# EAGLE design TinkerAccess Remote RFID (EAGLE 9.6.2)
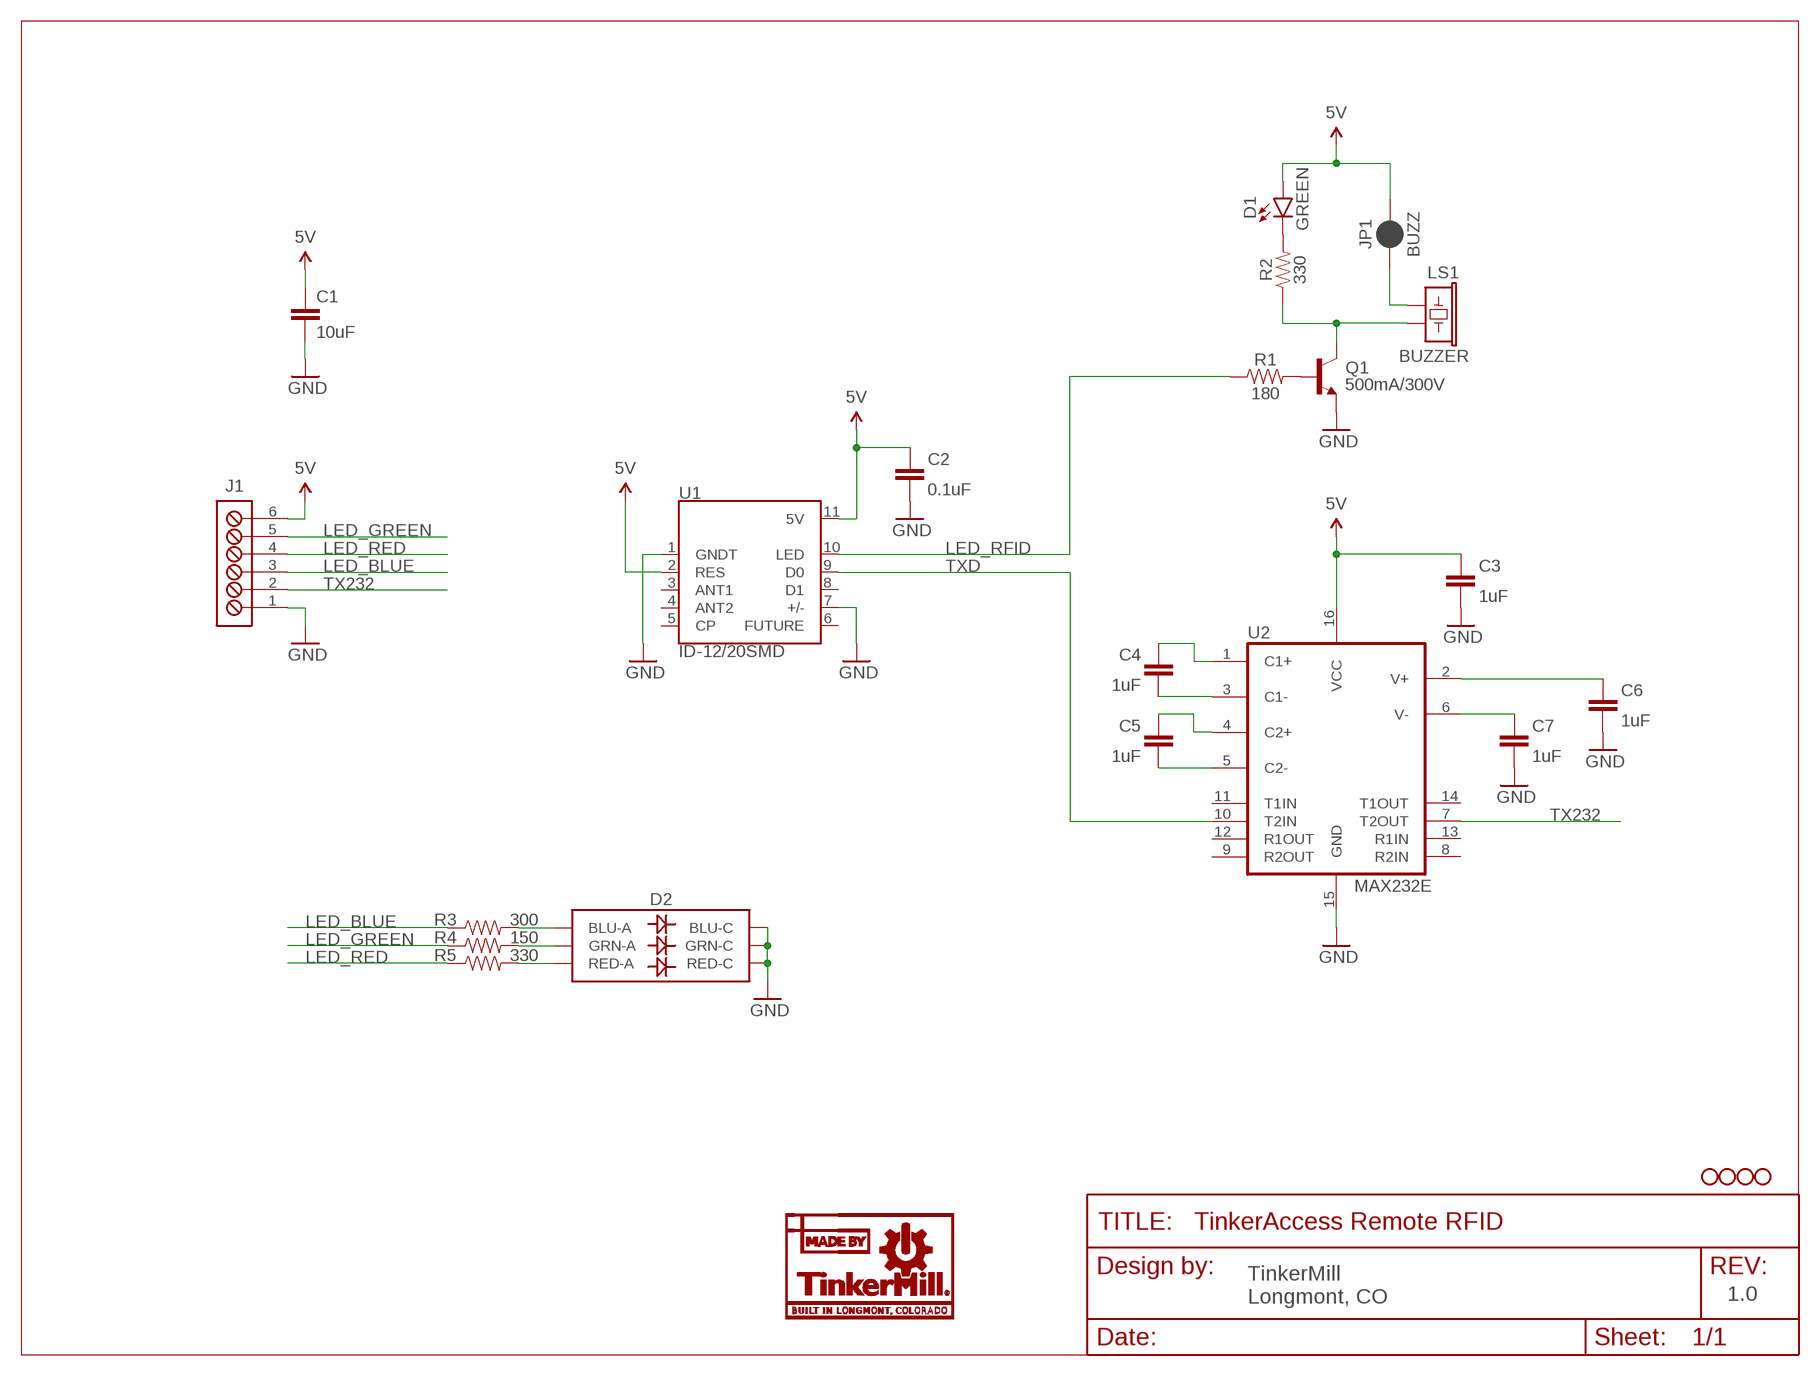
[diagram p0: schematic, sheet 1]

## Parts
C1  10uF  10UF-1206-6.3V-20%  [1206]
C2  0.1uF  0.1UF-0603-25V-(+80/-20%)  [0603]
C3  1uF  0.1UF-0603-25V-(+80/-20%)  [0603]
C4  1uF  0.1UF-0603-25V-(+80/-20%)  [0603]
C5  1uF  0.1UF-0603-25V-(+80/-20%)  [0603]
C6  1uF  0.1UF-0603-25V-(+80/-20%)  [0603]
C7  1uF  0.1UF-0603-25V-(+80/-20%)  [0603]
D1  GREEN  LED-GREEN1206  [LED-1206]
D2  LED-RGBNO_IC  [LED-TRICOLOR-5050]
J1  TB_6X1_TE_CONN_ED555_6DS  [TE_CONN_ED555_6DS]
JP1  BUZZ  JUMPER-SMT_2_NC_PASTE_NO-SILK  [SMT-JUMPER_2_NC_PASTE_NO-SILK]
LOGO1  MADE_BY_TINKERMILL  [MADE_BY_TINKERMILL]
LS1  BUZZER  BUZZER-SMD  [BUZZER-CCV]
Q1  500mA/300V  TRANS_NPN-MMBTA42  [SOT23-3]
R1  180  10MOHM-0603-1/10W-5%  [0603]
R2  330  10MOHM-0603-1/10W-5%  [0603]
R3  300  300OHM-0603-1/10W-1%  [0603]
R4  150  150OHM-0603-1/10W-1%  [0603]
R5  330  330OHM-0603-1/10W-1%  [0603]
STANDOFF1  STANDOFF_3.2MM_NO_CU_MASK  [STANDOFF_3.2MM_NO_CU_MASK]
STANDOFF2  STANDOFF_3.2MM_NO_CU_MASK  [STANDOFF_3.2MM_NO_CU_MASK]
STANDOFF3  STANDOFF_3.2MM_NO_CU_MASK  [STANDOFF_3.2MM_NO_CU_MASK]
STANDOFF4  STANDOFF_3.2MM_NO_CU_MASK  [STANDOFF_3.2MM_NO_CU_MASK]
U1  ID-12/20SMD  [ID-12_SMD]
U2  MAX232E  MAX232TSSOP  [TSSOP16]

## Nets
5V: C1.1 C2.2 C3.2 D1.A J1.6 JP1.2 U1.2(RES) U1.11(5V) U2.16(VCC)
GND: C1.2 C2.1 C3.1 C6.1 C7.1 D2.4(BLU-C) D2.5(RED-C) D2.6(GRN-C) J1.1 Q1.2(E) U1.1(GNDT) U1.7(+/-) U2.15(GND)
LED_BLUE: J1.3 R3.1
LED_GREEN: J1.5 R4.1
LED_RED: J1.4 R5.1
LED_RFID: R1.1 U1.10(LED)
N$1: Q1.1(B) R1.2
N$2: JP1.1 LS1.+
N$3: LS1.- Q1.3(C) R2.1
N$4: D1.C R2.2
N$5: C4.1 U2.3(C1-)
N$6: C4.2 U2.1(C1+)
N$7: C5.1 U2.5(C2-)
N$8: C5.2 U2.4(C2+)
N$9: D2.2(RED-A) R5.2
N$10: D2.1(GRN-A) R4.2
N$11: D2.3(BLU-A) R3.2
N$12: C6.2 U2.2(V+)
N$13: C7.2 U2.6(V-)
TX232: J1.2 U2.7(T2OUT)
TXD: U1.9(D0) U2.10(T2IN)
Unconnected: U1.3(ANT1) U1.4(ANT2) U1.5(CP) U1.6(FUTURE) U1.8(D1) U2.8(R2IN) U2.9(R2OUT) U2.11(T1IN) U2.12(R1OUT) U2.13(R1IN) U2.14(T1OUT)

## Notes on the sheet
- TinkerMill
  Longmont, CO
- 1.0

## Library data of the parts
C1 = SparkFun-Capacitors:10UF: 10.0µF ceramic capacitors A capacitor is a passive two-terminal electrical component used to store electrical energy temporarily in an electric field.; PROD_ID: CAP-10057
C2 = SparkFun-Capacitors:0.1UF: 0.1µF ceramic capacitors A capacitor is a passive two-terminal electrical component used to store electrical energy temporarily in an electric field.; PROD_ID: CAP-00810
C3-C7 = SparkFun-Capacitors:0.1UF: 0.1µF ceramic capacitors A capacitor is a passive two-terminal electrical component used to store electrical energy temporarily in an electric field.; PROD_ID: CAP-00810; VALUE: 0.1uF
D1 = SparkFun-LED:LED-GREEN: Green SMD LED Used in manufacturing of various products at SparkFun Packages: 0603 - SMD 0603 package [Product Link] <http://www.futureelectronics.com/en/technologies/semiconductors/optoelectronics/leds/Pages/9894312-LTST-C190GKT.aspx?CrossPart=HSMG-C190&IM=0> LilyPad 1206 - SMD1206 LilyPad package [Product Link] <http://www.futureelectronics.com/en/Technologies/Product.aspx?ProductID=IN150NGHARVATEKCORPORATION2049943&IM=0> 1206 - SMD1206 package [Product Link] <http://www.futureelectronics.com/en/technologies/semiconductors/optoelectronics/leds/Pages/8315665-LTST-C150KGKT.aspx?IM=0> 1206 Bottom Mount -SMD 1206 Bottom Mount [Product Link] <http://www.digikey.com/product-detail/en/lite-on-inc/LTST-C230KGKT/160-1456-1-ND/386854> SparkFun Products: Pro Mini 328 -5V <https://www.sparkfun.com/products/821> RedBoard <https://www.sparkfun.com/products/12757> MP3 Trigger <https://www.sparkfun.com/products/13720> Makey Makey <https://www.sparkfun.com/products/11076>; PROD_ID: DIO-00862
D2 = SparkFun-LED:LED-RGB: LED-RGB 6 pin RGB LED (no common connector) Packages: PLCC-6 LED-TRICOLOR-5050 - No built-in IC SparkFun Products: Digital Sandbox <https://www.sparkfun.com/products/12651> LED- SMD RGB <https://www.sparkfun.com/products/10866>; PROD_ID: DIO-10298
J1 = TMF_Connectors:TB_6X1
JP1 = SparkFun-Jumpers:JUMPER-SMT_2_NC_PASTE: Normally closed solder jumper This jumper has an aperture in the stencil to allow solder paste to bridge the split in the wire so it's normally closed (NC). Wick off the solder to open the connection. Reapply solder to reclose the connection.
LOGO1 = TinkerMill:MADE_BY_TINKERMILL
LS1 = SparkFun-Electromechanical:BUZZER: Buzzer Small round buzzers that operate around the audible 2kHz range. You can use these as speakers to create simple music or user interfaces. Variant Overview: PTH - Mini Speaker - PC Mount 12mm 2.048kHz <https://www.sparkfun.com/products/7950> PTH_KIT - Mini Speaker - PC Mount 12mm 2.048kHz <https://www.sparkfun.com/products/7950> KIT simplifies soldering by adding stop mask to one side of the pads. PTH_NO_SILK - Mini Speaker - PC Mount 12mm 2.048kHz <https://www.sparkfun.com/products/7950> No silkscreen indicator of buzzer outline. PTH_KIT_NO_SILK - Mini Speaker - PC Mount 12mm 2.048kHz <https://www.sparkfun.com/products/7950> KIT package w/o silkscreen SMD - Buzzer Audio Magnetic (CCV-084B16) SMD buzzer used on, e.g. the LilyPad Buzzer <https://www.sparkfun.com/products/8463> and RFID USB Reader <https://www.sparkfun.com/products/9963>. SMD_KIT - Buzzer Audio Magnetic (CCV-084B16) SMD Buzzer with elongated pins to make soldering easier. Used on the SparkFun Simon Says - Surface Mount Soldering Kit <https://www.sparkfun.com/products/10935>.; PROD_ID: COMP-08568
Q1 = SparkFun-DiscreteSemi:TRANS_NPN: NPN transistor Current controlled devices typically used to amplify current or used as a switch. BC547 - COM-08928 <http://www.sparkfun.com/products/8928> (TO-92 45V 100mA) (1.Collector 2.Base 3.Emitter) 2N3904 - COM-00521 <http://www.sparkfun.com/products/521> (TO-92 40V 200mA) (1.Emitter 2.Base 3.Collector) P2N2222A - COM-12852 <http://www.sparkfun.com/products/12852> (TO-92 40V 600mA) (1.Collector 2.Base 3.Emitter); PROD_ID: TRANS-09116
R1 R2 = SparkFun-Resistors:10MOHM: RES-09327; PROD_ID: RES-08283; VALUE: 10M
R3 = SparkFun-Resistors:300OHM: 300Ω resistor A resistor is a passive two-terminal electrical component that implements electrical resistance as a circuit element. Resistors act to reduce current flow, and, at the same time, act to lower voltage levels within circuits. - Wikipedia; PROD_ID: RES_10328
R4 = SparkFun-Resistors:150OHM: 150Ω resistor A resistor is a passive two-terminal electrical component that implements electrical resistance as a circuit element. Resistors act to reduce current flow, and, at the same time, act to lower voltage levels within circuits. - Wikipedia; PROD_ID: RES-11028
R5 = SparkFun-Resistors:330OHM: 330Ω resistor A resistor is a passive two-terminal electrical component that implements electrical resistance as a circuit element. Resistors act to reduce current flow, and, at the same time, act to lower voltage levels within circuits. - Wikipedia; PROD_ID: RES-00818
STANDOFF1-STANDOFF4 = TMF_Hardware:STANDOFF
U1 = SparkFun-RF:ID-12/20: ID Innovations 125kHz RFID Reader (ID2, ID3, ID12, and ID20) The IDS, ID3, ID12, and ID20 are very simple to use RFID reader modules. Power the module, hold up a 125kHz card, and get a serial string output containing the unique ID of the card. SparkFun Products RFID Reader ID-3LA (125 kHz) <https://www.sparkfun.com/products/11862> (SEN-11862) RFID Reader ID-12LA (125 kHz) <https://www.sparkfun.com/products/11827> (SEN-11827) RFID Reader ID-20LA (125 kHz) <https://www.sparkfun.com/products/11828> (SEN-11828) SparkFun RFID USB Reader <https://www.sparkfun.com/products/9963> (SEN-9963); PROD_ID: CONN-09345, CONN-09344
U2 = SparkFun-DigitalIC:MAX232: RS232 Transceiver Very common IC. This is generically called 'MAX232', but works with the 3V equivalent MAX3232 generic ICs. Field tested and mother approved. Spark Fun Electronics SKU : COM-00316 (DIP) and COM-00589 (SMD)

## Board
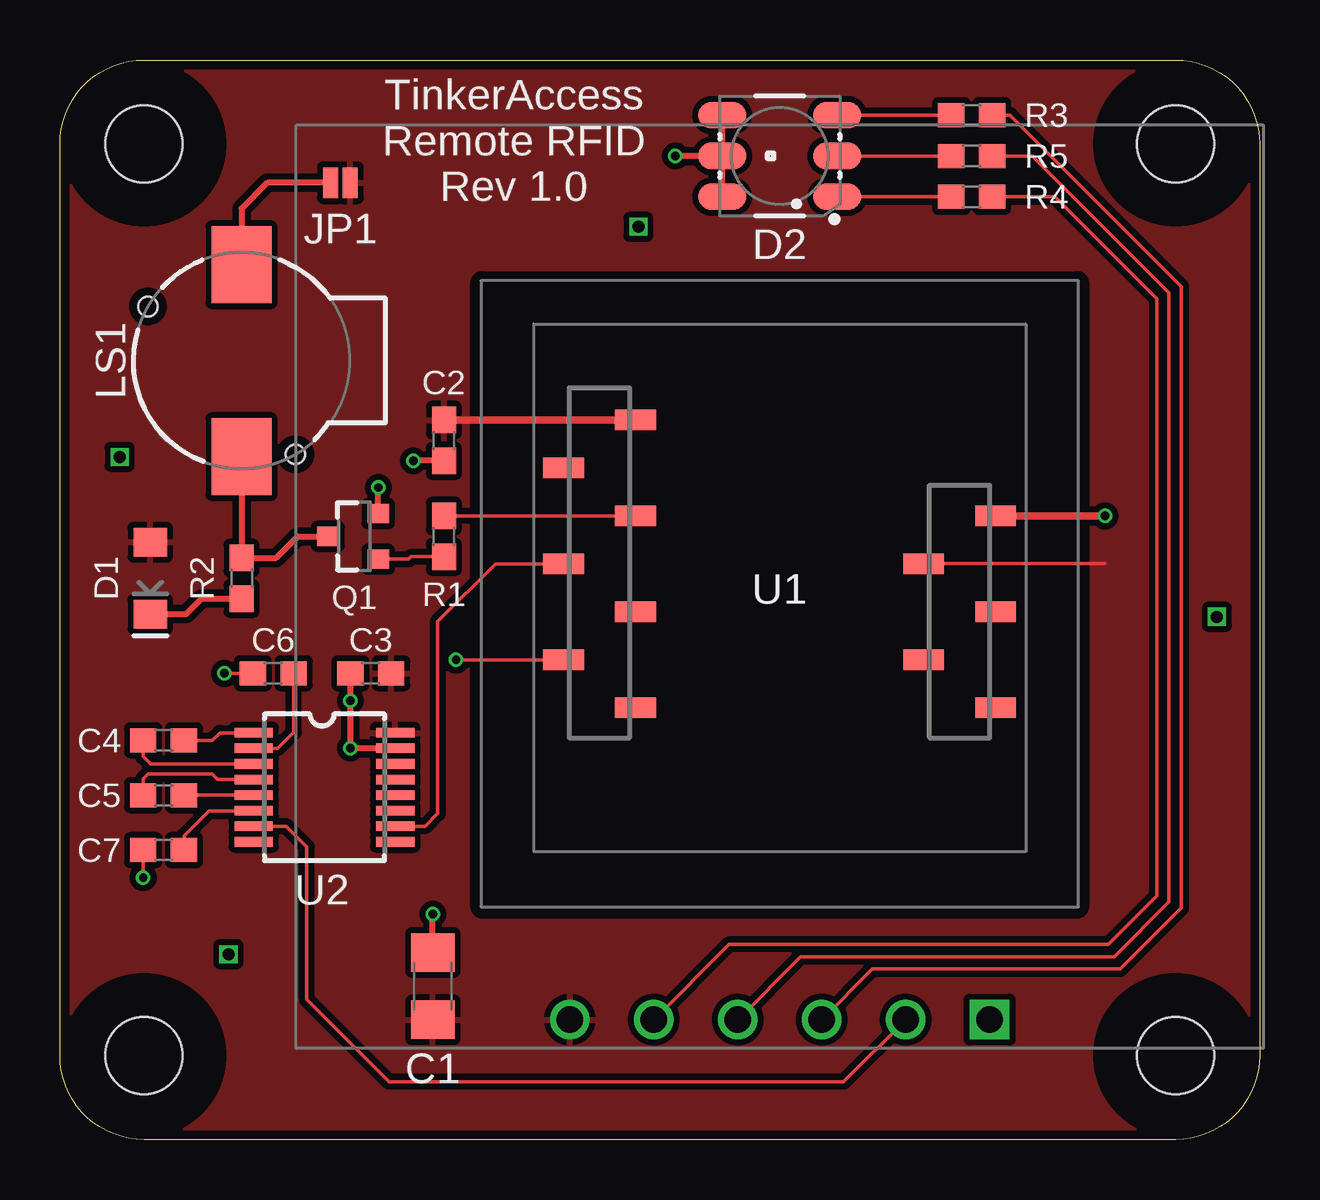
[diagram p1: board, top side]
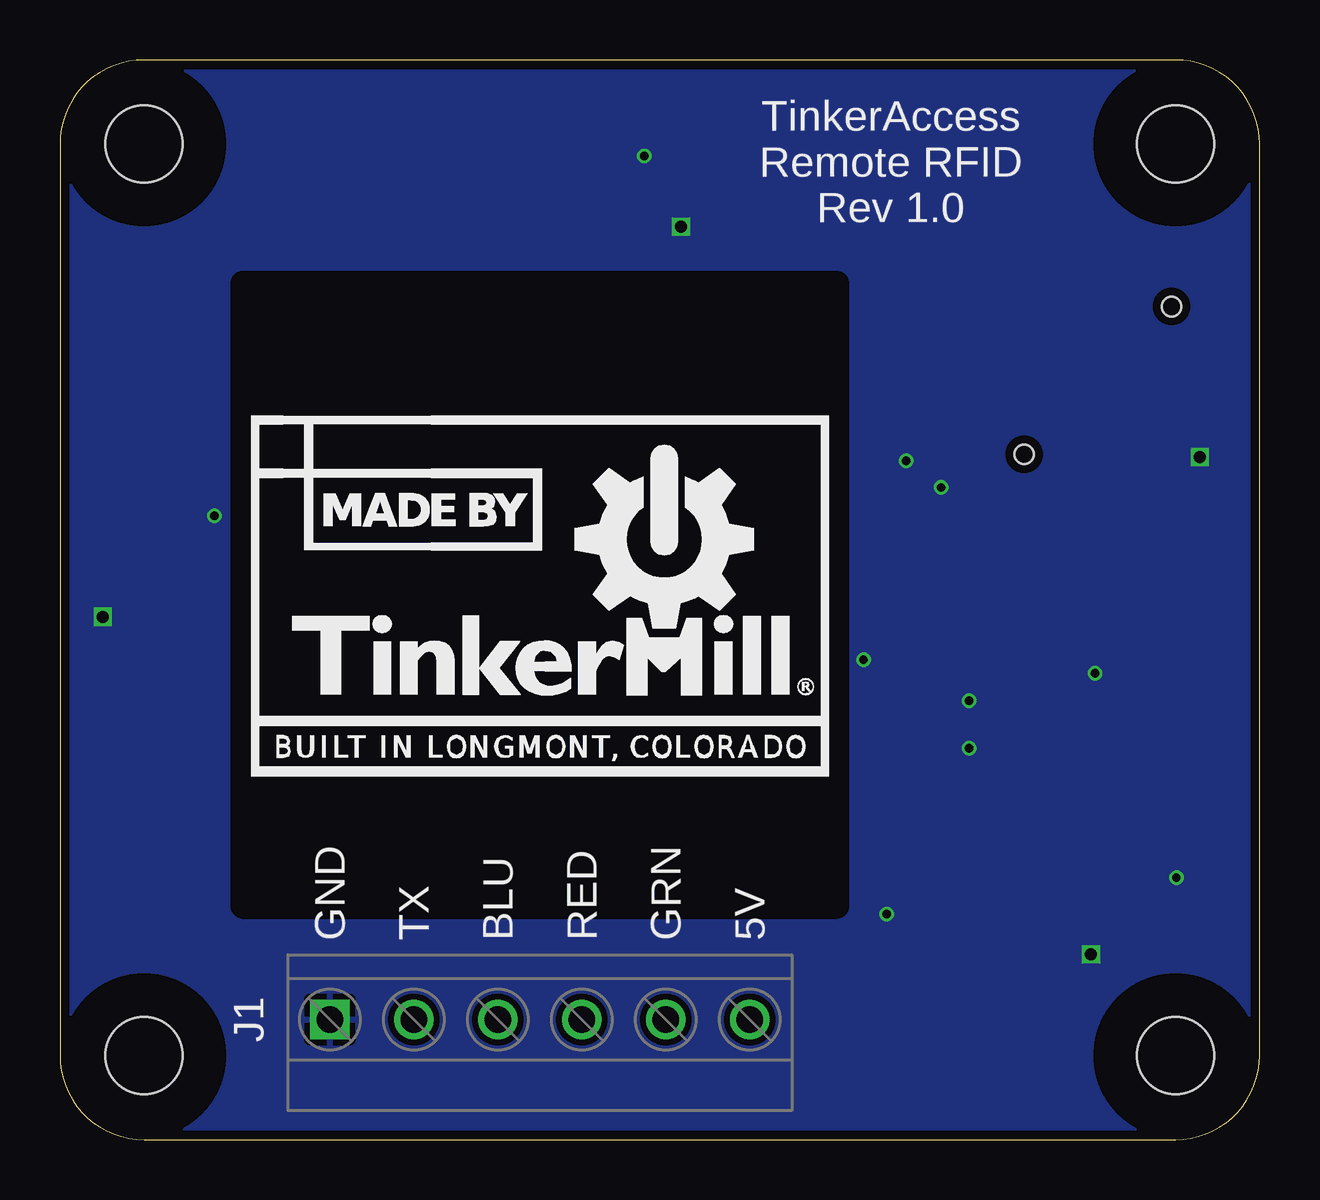
[diagram p2: board, bottom side, seen from below]

Size 50 x 45 mm. Coordinates in mm from the lower left corner, seen from the top.
Outline: 46.5,0 3.5,0 arc-90 0,3.5 0,41.5 arc-90 3.5,45 46.5,45 arc-90 50,41.5 50,3.5 arc-90 46.5,0
Copper layers (1*16): Top 0.035559375mm / dielectric 1.6mm / Bottom 0.035559375mm
Design rules "oshpark-2layer": minimum track width 6mil, minimum drill 10mil, track to track 6mil, track to pad 6mil, pad to pad 6mil, via to via 6mil, smd to smd 6mil, copper to edge 15mil, drill to drill 6mil, minimum pad ring 5mil, minimum via ring 5mil, stop-mask expansion 2.5mil, vias tented up to drill 0mil, thermal gap 10mil
tRestrict: area 17.6,9.7 to 42.4,35.7
bRestrict: area 17.6,9.7 to 42.4,35.7

### Footprints (pad centres in the part's own frame; a part is rotated, then mirrored left to right if it is on the bottom)
1206 = smd 1.6 x 1.8: 1 -1.4,0; 2 1.4,0
0603 = smd 1.1 x 1: 1 -0.85,0; 2 0.85,0
LED-1206 = smd 1.2 x 1.4: A -1.5,0; C 1.5,0
LED-TRICOLOR-5050 = smd 2 x 1.1: 1 -2.4,1.7; 2 -2.4,0; 3 -2.4,-1.7; 4 2.4,-1.7; 5 2.4,0; 6 2.4,1.7
TE_CONN_ED555_6DS = drill 1.1 square: 1 0,8.75 | drill 1.1: 2 0,5.25; 3 0,1.75; 4 0,-1.75; 5 0,-5.25; 6 0,-8.75
SMT-JUMPER_2_NC_PASTE_NO-SILK = smd 0.635 x 1.27: 1 -0.406,0; 2 0.406,0
BUZZER-CCV = smd 3.2 x 2.5: + 4,0; - -4,0 | hole 0.8: -3.9,-2.25; 2.25,3.9
SOT23-3 = smd 0.8 x 0.9: 1 -0.95,-1; 2 0.95,-1; 3 0,1.1
STANDOFF_3.2MM_NO_CU_MASK = hole 3.2: 0,0
ID-12_SMD = smd 0.85 x 1.7: 1 2.993,-8.998; 2 0.993,-5.998; 3 -1.007,-8.998; 4 -3.007,-5.998; 5 -5.007,-8.998; 6 -5.007,6.013; 7 -3.007,9.013; 8 -1.007,6.013; 9 0.993,9.013; 10 2.993,6.013; 11 6.993,6.013; NC 4.993,9.013
TSSOP16 = smd 0.4 x 1.6: 1 -2.225,-2.85; 2 -1.575,-2.85; 3 -0.925,-2.85; 4 -0.275,-2.85; 5 0.375,-2.85; 6 1.025,-2.85; 7 1.675,-2.85; 8 2.325,-2.85; 9 2.325,3.05; 10 1.675,3.05; 11 1.025,3.05; 12 0.375,3.05; 13 -0.275,3.05; 14 -0.925,3.05; 15 -1.575,3.05; 16 -2.225,3.05

### Placement (x,y rotation side)
C1  15.54,6.4 90 top
C2  16,29.14 90 top
C3  12.95,19.43 0 top
C4  4.32,16.64 0 top
C5  4.32,14.35 180 top
C6  8.89,19.43 0 top
C7  4.32,12.06 0 top
D1  3.77,23.4 270 top
D2  30,41 180 top
J1  30,5 90 bottom
JP1  11.68,39.88 0 top
LOGO1  42.04,15.16 0 bottom
LS1  7.57,32.47 90 top
Q1  12.27,25.14 90 top
R1  16,25.14 270 top
R2  7.57,23.4 270 top
R3  38,42.7 180 top
R4  38,39.3 180 top
R5  38,41 180 top
STANDOFF1  3.5,3.5 0 top
STANDOFF2  3.5,41.5 0 top
STANDOFF3  46.5,41.5 0 top
STANDOFF4  46.5,3.5 0 top
U1  30,23 90 top
U2  10.92,14.73 270 top

### Tracks (layer width: path | path; a pad name or v marks a point on that pad's centre or on a via)
5V
  Top 0.152: U1.2 36.01,24 43.56,24
  Top 0.305: U1.11 C2.2
  pour Top (isolate 0.254): 50,45 50,0 0,0 0,45
GND  (via drill 0.35, 0.5 pad 0.55)
  Top 0.152: U1.7 v16.51,19.99 | C6.1 v6.86,19.43 | C7.1 v3.47,10.92
  Top 0.254: D2.5 v25.65,41 | D2.4 D2.5 | D2.5 D2.6 | C2.1 v14.73,28.29 | Q1.2 v13.27,27.18 | C3.1 v12.1,18.29 v12.1,16.31 U2.15 | C1.2 v15.54,9.4
  Top 0.305: U1.1 v43.56,25.99
  other vias: 24.11,38.05 2.48,28.45 7.02,7.73 48.23,21.79
  pour Bottom (isolate 0.254): 50,45 50,0 0,0 0,45
LED_BLUE
  Top 0.152: J1.3 33.86,7.11 44.2,7.11 46.74,9.65 46.74,35.56 39.6,42.7 R3.1
LED_GREEN
  Top 0.152: R4.1 41.47,39.3 45.72,35.05 45.72,10.16 43.69,8.13 27.88,8.13 J1.5
LED_RED
  Top 0.152: R5.1 40.53,41 46.23,35.31 46.23,9.91 43.94,7.62 30.87,7.62 J1.4
LED_RFID
  Top 0.152: U1.10 R1.1
N$1
  Top 0.152: Q1.1 14.54,24.19 14.64,24.29 R1.2
N$2
  Top 0.254: JP1.1 8.64,39.88 7.57,38.81 LS1.+
N$3
  Top 0.254: Q1.3 9.9,25.14 9.01,24.25 R2.1 LS1.-
N$4
  Top 0.254: D1.C 5.26,21.9 5.91,22.55 R2.2
N$5
  Top 0.152: U2.3 3.77,15.66 3.47,15.96 C4.1
N$6
  Top 0.152: C4.2 6.35,16.64 6.67,16.96 U2.1
N$7
  Top 0.152: C5.1 U2.5
N$8
  Top 0.152: C5.2 3.47,15.03 3.68,15.24 6.35,15.24 6.58,15.01 U2.4
N$9
  Top 0.152: D2.2 R5.2
N$10
  Top 0.152: D2.1 R4.2
N$11
  Top 0.152: D2.3 R3.2
N$12
  Top 0.152: U2.2 9.07,16.31 9.74,16.98 C6.2
N$13
  Top 0.152: C7.2 5.17,12.66 6.21,13.71 U2.6
TX232
  Top 0.152: J1.2 32.66,2.41 13.72,2.41 10.29,5.84 10.29,12.19 9.42,13.06 U2.7
TXD
  Top 0.152: U1.9 18.15,23.99 15.75,21.59 15.75,13.59 15.22,13.06 U2.10

### Text on the board
tPlace: TinkerAccess / Remote RFID / Rev 1.0
bPlace: TinkerAccess / Remote RFID / Rev 1.0
bNames: 5V | GRN | RED | BLU | TX | GND
tSilk: Sensitivity